# EAGLE schematic motherboard (EAGLE 5.10)
WV: 10V

## Sheet 1 of 7
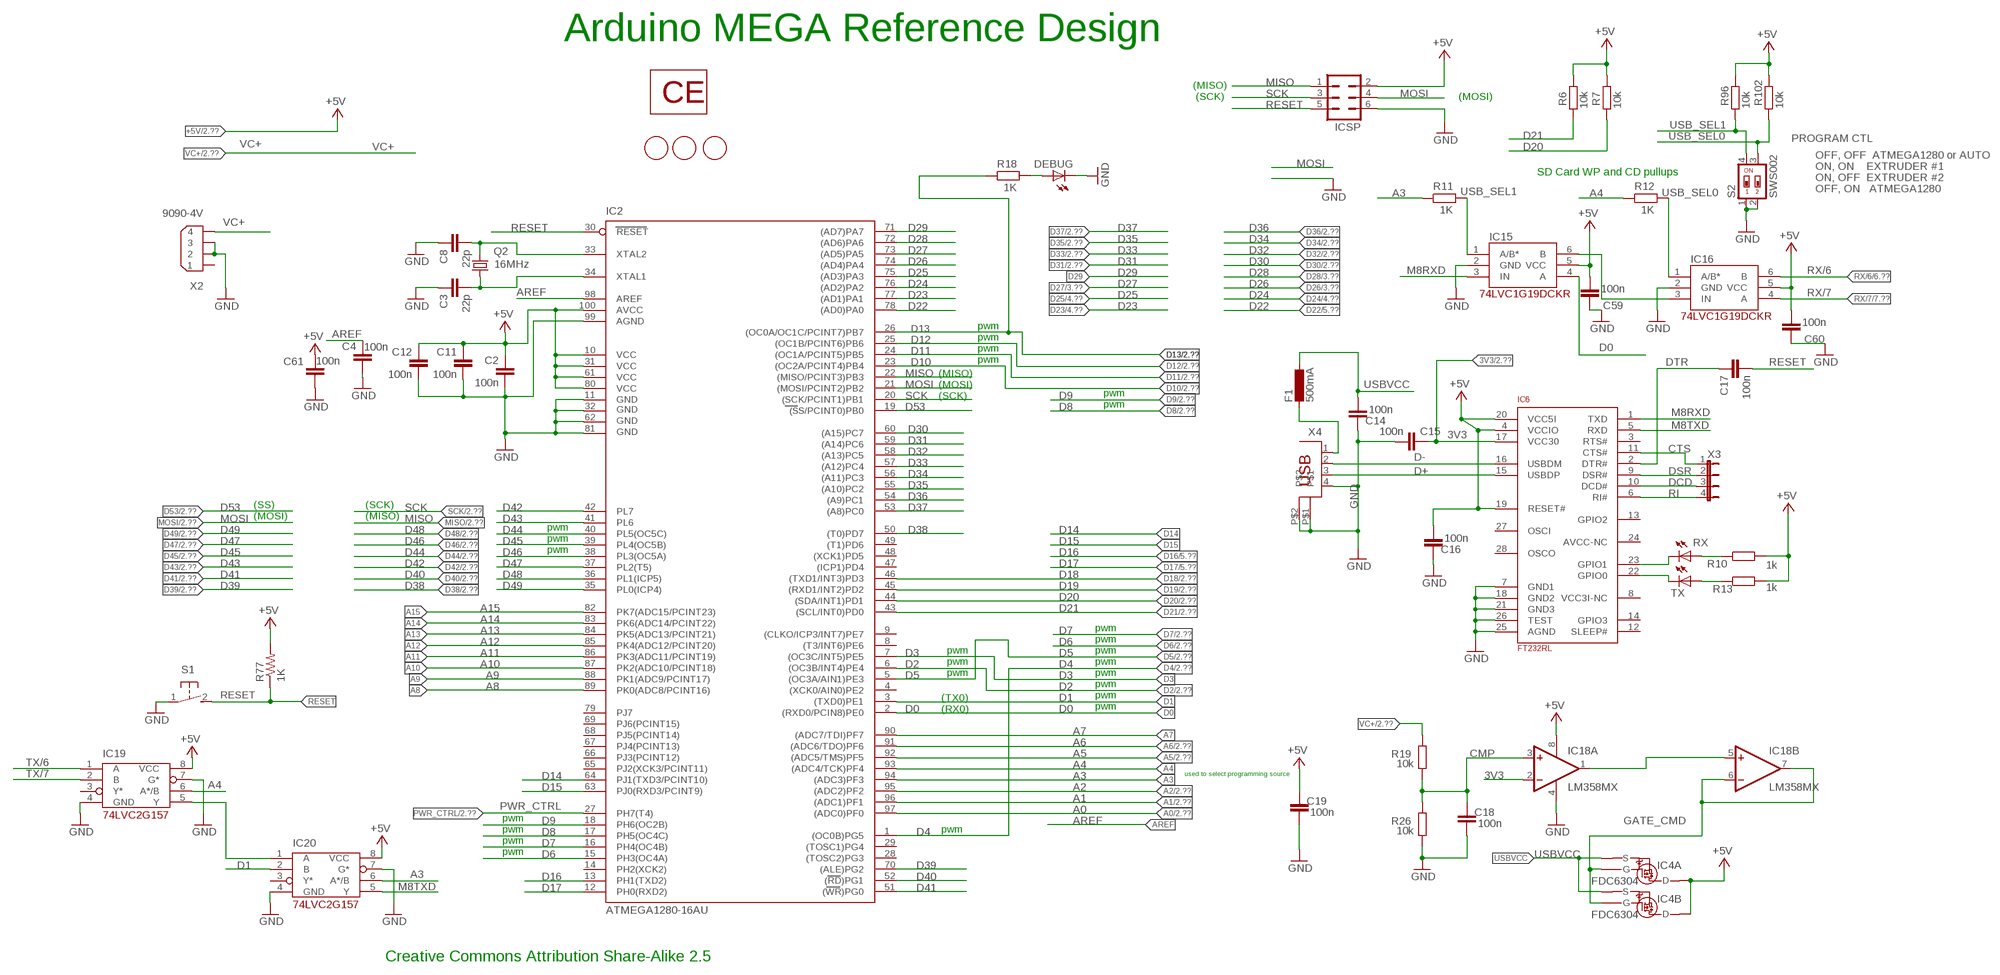
[diagram p0: schematic, sheet 1]

### Parts
C2  100n  C-EU  [C0805RND]
C3  22p  C-EU  [C0805RND]
C4  100n  C-EU  [C0805RND]
C8  22p  C-EU  [C0805RND]
C11  100n  C-EU  [C0805RND]
C12  100n  C-EU  [C0805RND]
C14  100n  C-EU  [C0805RND]
C15  100n  C-EU  [C0805RND]
C16  100n  C-EU  [C0805RND]
C17  100n  C-EU  [C0805RND]
C18  100n  C-EU  [C0805RND]
C19  100n  C-EU  [C0805RND]
C59  100n  C-EU  [C0805RND]
C60  100n  C-EU  [C0805RND]
C61  100n  C-EU  [C0805RND]
DEBUG  LED0805ROUND  [0805RND]
F1  500mA  L-EUL1812  [L1812]
IC2  ATMEGA1280-16AU  [TQFP100]
IC4  FDC6304  [FDC6304]
IC6  FT232RL  [SSOP28]
IC15  741G19  [SC70-6]
IC16  741G19  [SC70-6]
IC18  LM358MX  [SO08]
IC19  74LVC2G157  [DCU_R-PDSO-G8]
IC20  74LVC2G157  [DCU_R-PDSO-G8]
ICSP  ML6  [ML6]
Q2  16MHz  CRYTALHC49S  [HC49/S]
R6  10k  R-EU_  [R0805RND]
R7  10k  R-EU_  [R0805RND]
R10  1k  R-EU_  [R0805RND]
R11  1K  R-EU_  [R0805RND]
R12  1K  R-EU_  [R0805RND]
R13  1k  R-EU_  [R0805RND]
R18  1K  R-EU_  [R0805RND]
R19  10k  R-EU_  [R0805RND]
R26  10k  R-EU_  [R0805RND]
R77  1K  RESISTOR  [0805]
R96  10k  R-EU_  [R0805RND]
R102  10k  R-EU_  [R0805RND]
RX  LED0805ROUND  [0805RND]
S1  31-XX  [B3F-31XX]
S2  SWS002  [SMS-002]
TX  LED0805ROUND  [0805RND]
U$3  FIDUCIALMOUNT  [FIDUCIA-MOUNT]
U$8  FIDUCIALMOUNT  [FIDUCIA-MOUNT]
U$9  FIDUCIALMOUNT  [FIDUCIA-MOUNT]
U$10  CE  [CE-COPPER]
X2  9090-4V  [9090-4V]
X3  JP4E  [JP4]
X4  PN61729  [PN61729]

### Nets
3V3: C15.2 IC6.17(VCC30) IC18.2(A:-IN) ; also sheet 2
+5V [5V_power]: C2.1 C11.1 C12.1 C16.1 C19.2 C59.1 C60.1 C61.1 IC2.10(VCC) IC2.31(VCC1) IC2.61(VCC2) IC2.80(VCC3) IC2.100(AVCC) IC4.4(B:D) IC4.6(A:D) IC6.4(VCCIO) IC6.19(RESET#) IC6.20(VCC5I) IC15.5(VCC) IC16.5(VCC) IC18.8(P:V+) IC19.8(VCC) IC20.8(VCC) ICSP.2 R6.1 R7.1 R10.2 R13.2 R77.2 R96.1 R102.1 ; also sheet 2,3,4,5,6,7
A0: IC2.97((ADC0)PF0) ; also sheet 2
A1: IC2.96((ADC1)PF1) ; also sheet 2
A2: IC2.95((ADC2)PF2) ; also sheet 2
A3: IC2.94((ADC3)PF3) IC20.6(A*/B) R11.1
A4: IC2.93((ADC4/TCK)PF4) IC19.6(A*/B) R12.1
A5: IC2.92((ADC5/TMS)PF5) ; also sheet 2
A6: IC2.91((ADC6/TDO)PF6) ; also sheet 2
A7: IC2.90((ADC7/TDI)PF7)
A8: IC2.89(PK0(ADC8/PCINT16))
A9: IC2.88(PK1(ADC9/PCINT17))
A10: IC2.87(PK2(ADC10/PCINT18))
A11: IC2.86(PK3(ADC11/PCINT19))
A12: IC2.85(PK4(ADC12/PCINT20))
A13: IC2.84(PK5(ADC13/PCINT21))
A14: IC2.83(PK6(ADC14/PCINT22))
A15: IC2.82(PK7(ADC15/PCINT23))
AREF: C4.1 IC2.98(AREF)
CMP: C18.2 IC18.3(A:+IN) R19.1 R26.2
CTS: IC6.11(CTS#) X3.1
D0: IC2.2((RXD0/PCIN8)PE0) IC15.4(A)
D1: IC2.3((TXD0)PE1) IC20.2(B)
D2: IC2.6((OC3B/INT4)PE4) ; also sheet 2
D3: IC2.7((OC3C/INT5)PE5)
D4: IC2.1((OC0B)PG5) ; also sheet 2
D5: IC2.5((OC3A/AIN1)PE3) ; also sheet 2
D6: IC2.15(PH3(OC4A)) ; also sheet 2
D7: IC2.16(PH4(OC4B)) ; also sheet 2
D8: IC2.17(PH5(OC4C)) ; also sheet 2
D9: IC2.18(PH6(OC2B)) ; also sheet 2
D10: IC2.23((OC2A/PCINT4)PB4) ; also sheet 2
D11: IC2.24((OC1A/PCINT5)PB5) ; also sheet 2
D12: IC2.25((OC1B/PCINT6)PB6) ; also sheet 2
D13: IC2.26((OC0A/OC1C/PCINT7)PB7) R18.1 ; also sheet 2
D14: IC2.64(PJ1(TXD3/PCINT10))
D15: IC2.63(PJ0(RXD3/PCINT9))
D16: IC2.13(PH1(TXD2)) ; also sheet 5
D17: IC2.12(PH0(RXD2)) ; also sheet 5
D18: IC2.46((TXD1/INT3)PD3) ; also sheet 2
D19: IC2.45((RXD1/INT2)PD2) ; also sheet 2
D20: IC2.44((SDA/INT1)PD1) R7.2 ; also sheet 2
D21: IC2.43((SCL/INT0)PD0) R6.2 ; also sheet 2
D22: IC2.78((AD0)PA0) ; also sheet 5
D23: IC2.77((AD1)PA1) ; also sheet 4
D24: IC2.76((AD2)PA2) ; also sheet 4
D25: IC2.75((AD3)PA3) ; also sheet 4
D26: IC2.74((AD4)PA4) ; also sheet 3
D27: IC2.73((AD5)PA5) ; also sheet 3
D28: IC2.72((AD6)PA6) ; also sheet 3
D29: IC2.71((AD7)PA7)
D30: IC2.60((A15)PC7) ; also sheet 2
D31: IC2.59((A14)PC6) ; also sheet 2
D32: IC2.58((A13)PC5) ; also sheet 2
D33: IC2.57((A12)PC4) ; also sheet 2
D34: IC2.56((A11)PC3) ; also sheet 2
D35: IC2.55((A10)PC2) ; also sheet 2
D36: IC2.54((A9)PC1) ; also sheet 2
D37: IC2.53((A8)PC0) ; also sheet 2
D38: IC2.50((T0)PD7) ; also sheet 2
D39: IC2.70((ALE)PG2) ; also sheet 2
D40: IC2.52((RD)PG1) ; also sheet 2
D41: IC2.51((WR)PG0) ; also sheet 2
D42: IC2.42(PL7) ; also sheet 2
D43: IC2.41(PL6) ; also sheet 2
D44: IC2.40(PL5(OC5C)) ; also sheet 2
D45: IC2.39(PL4(OC5B)) ; also sheet 2
D46: IC2.38(PL3(OC5A)) ; also sheet 2
D47: IC2.37(PL2(T5)) ; also sheet 2
D48: IC2.36(PL1(ICP5)) ; also sheet 2
D49: IC2.35(PL0(ICP4)) ; also sheet 2
D53: IC2.19((SS/PCINT0)PB0) ; also sheet 2
D+: IC6.15(USBDP) X4.3
D-: IC6.16(USBDM) X4.2
DCD: IC6.10(DCD#) X3.3
DSR: IC6.9(DSR#) X3.2
DTR: C17.1 IC6.2(DTR#)
GATE_CMD: IC4.1(A:G) IC4.3(B:G) IC18.6(B:-IN) IC18.7(B:OUT)
GND [gnd]: C2.2 C3.1 C4.2 C8.1 C11.2 C12.2 C14.2 C15.1 C16.2 C18.1 C19.1 C59.2 C60.2 C61.2 DEBUG.P$2(C) IC2.11(GND) IC2.32(GND1) IC2.62(GND2) IC2.81(GND3) IC2.99(AGND) IC6.7(GND1) IC6.18(GND2) IC6.21(GND3) IC6.25(AGND) IC6.26(TEST) IC15.2(GND) IC16.2(GND) IC18.4(P:V-) IC19.4(GND) IC19.7(G*) IC20.4(GND) IC20.7(G*) ICSP.6 R26.1 S1.1(P) S2.1 S2.2 X2.2 X2.3 X4.4 X4.P$1 X4.P$2 ; also sheet 2,3,4,5,6,7
M8RXD: IC6.1(TXD) IC15.3(IN)
M8TXD: IC6.5(RXD) IC20.5(Y)
MISO: IC2.22((MISO/PCINT3)PB3) ICSP.1 ; also sheet 2
MOSI: IC2.21((MOSI/PCINT2)PB2) ICSP.4 ; also sheet 2
N$6: C3.2 IC2.34(XTAL1) Q2.1
N$7: C8.2 IC2.33(XTAL2) Q2.2
N$8: DEBUG.P$1(A) R18.2
N$9: IC18.1(A:OUT) IC18.5(B:+IN)
N$15: IC6.23(GPIO1) RX.P$2(C)
N$53: IC6.22(GPIO0) TX.P$2(C)
N$54: R10.1 RX.P$1(A)
N$55: R13.1 TX.P$1(A)
N$60 [usbvcc]: F1.2 X4.1
N$101: IC15.6(B) IC16.3(IN)
PWR_CTRL: IC2.27(PH7(T4)) ; also sheet 2
RESET: C17.2 IC2.30(RESET) ICSP.5 R77.1 S1.2(S)
RI: IC6.6(RI#) X3.4
RX/6: IC16.6(B) ; also sheet 6
RX/7: IC16.4(A) ; also sheet 7
SCK: IC2.20((SCK/PCINT1)PB1) ICSP.3 ; also sheet 2
TX67_SEL: IC19.5(Y) IC20.1(A)
TX/6: IC19.1(A) ; also sheet 6
TX/7: IC19.2(B) ; also sheet 7
USB_SEL0: IC16.1(A/B*) R12.2 R102.2 S2.3
USB_SEL1: IC15.1(A/B*) R11.2 R96.2 S2.4
USBVCC [usbvcc]: C14.1 F1.1 IC4.2(B:S) IC4.5(A:S)
VC+ [12V_power]: R19.2 X2.4 ; also sheet 2,3,4,5,6,7
Unconnected: IC2.4((XCK0/AIN0)PE2) IC2.8((T3/INT6)PE6) IC2.9((CLKO/ICP3/INT7)PE7) IC2.14(PH2(XCK2)) IC2.28((TOSC2)PG3) IC2.29((TOSC1)PG4) IC2.47((ICP1)PD4) IC2.48((XCK1)PD5) IC2.49((T1)PD6) IC2.65(PJ2(XCK3/PCINT11)) IC2.66(PJ3(PCINT12)) IC2.67(PJ4(PCINT13)) IC2.68(PJ5(PCINT14)) IC2.69(PJ6(PCINT15)) IC2.79(PJ7) IC6.3(RTS#) IC6.8(VCC3I-NC) IC6.12(SLEEP#) IC6.13(GPIO2) IC6.14(GPIO3) IC6.24(AVCC-NC) IC6.27(OSCI) IC6.28(OSCO) IC19.3(Y*) IC20.3(Y*) X2.1

### Notes on the sheet
- Arduino MEGA Reference Design
- (MISO)
- (SCK) | (MOSI)
- PROGRAM CTL
- OFF, OFF  ATMEGA1280 or AUTO
- ON, ON    EXTRUDER #1
- SD Card WP and CD pullups
- ON, OFF  EXTRUDER #2
- OFF, ON   ATMEGA1280
- pwm
- pwm
- pwm
- pwm
- (MISO)
- (MOSI)
- (SCK) | pwm
- pwm
- (SS) | (SCK)
- (MOSI) | (MISO)
- pwm
- pwm
- pwm
- pwm
- pwm
- pwm | pwm
- pwm | pwm
- pwm | pwm
- pwm
- (TX0) | pwm
- (RX0) | pwm
- used to select programming source
- pwm
- pwm | pwm
- pwm
- pwm
- Creative Commons Attribution Share-Alike 2.5

## Sheet 2 of 7
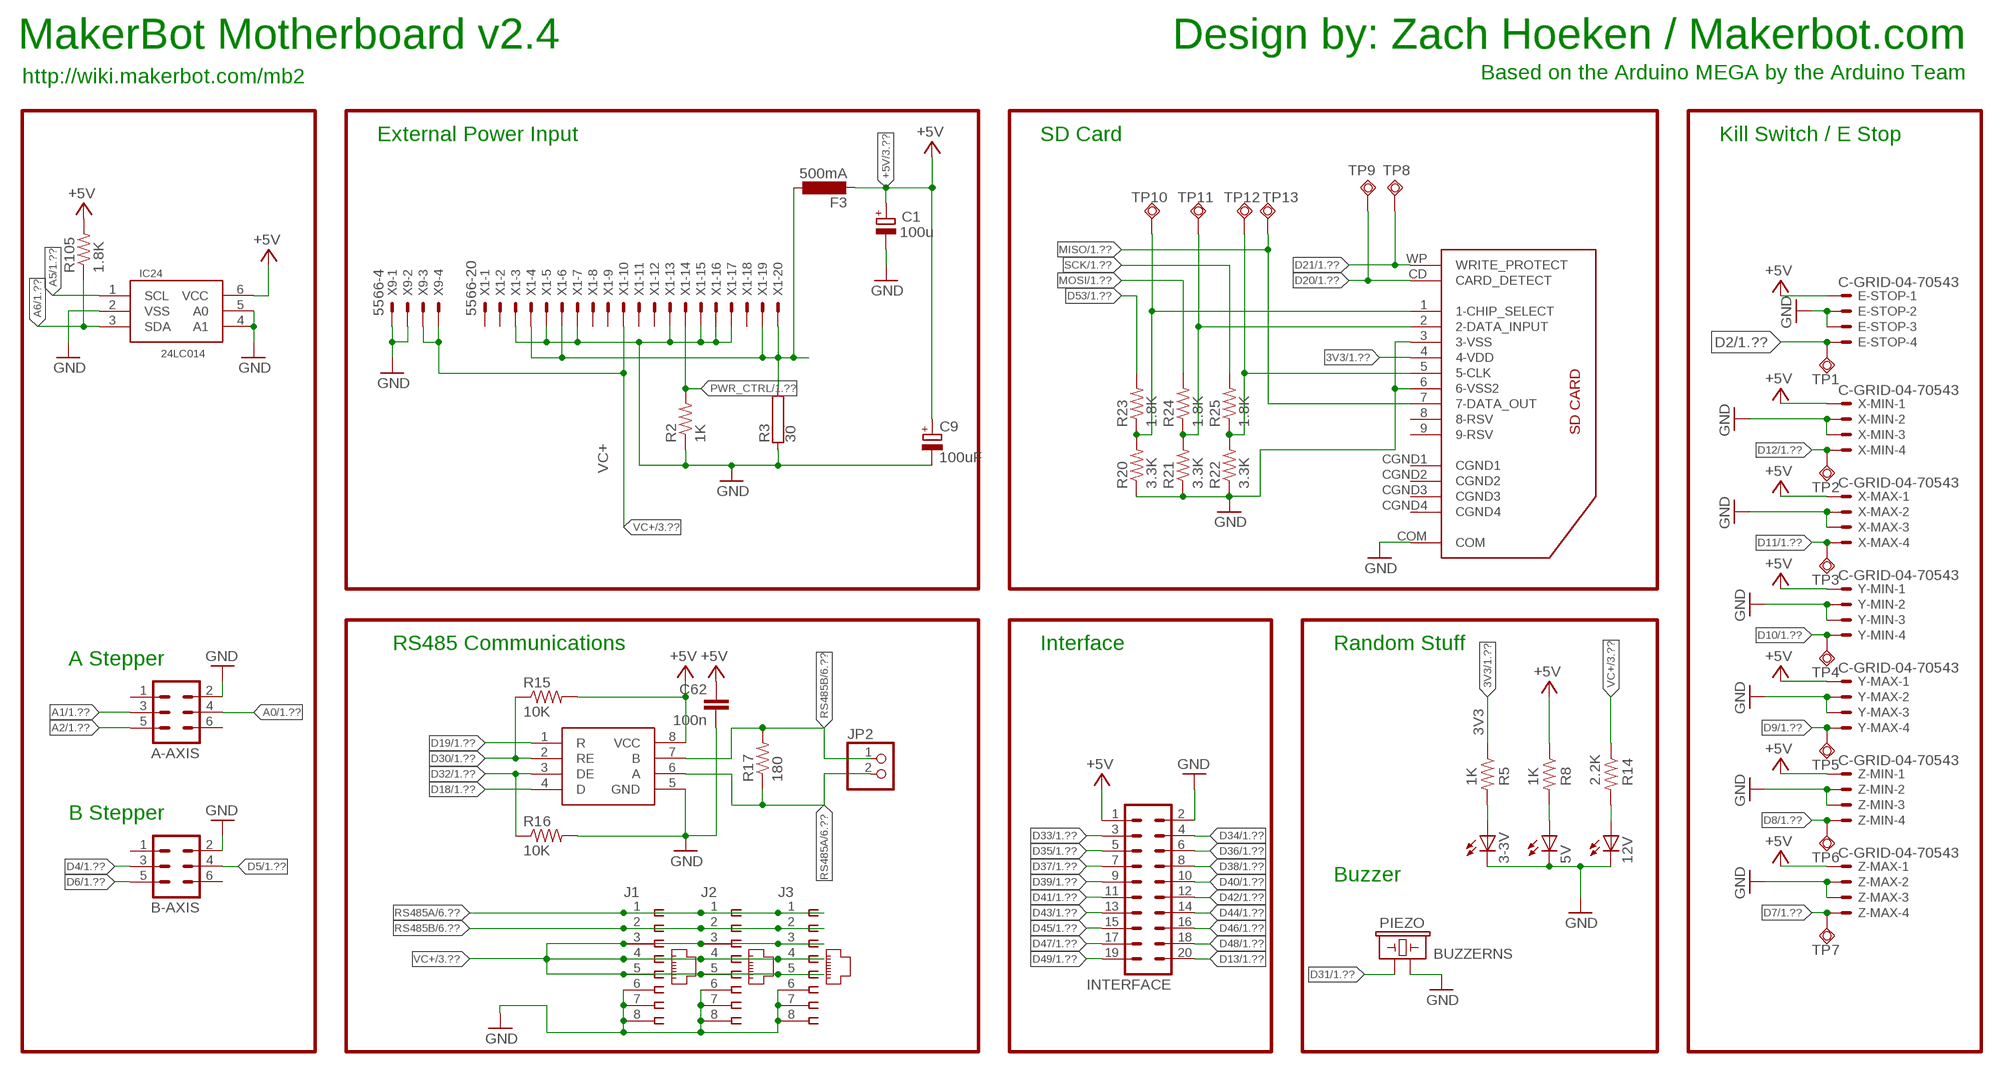
[diagram p1: schematic, sheet 2]

### Parts
3-3V  LED0805  [LED-0805]
5V  LED0805  [LED-0805]
12V  LED0805  [LED-0805]
A-AXIS  ML6  [ML6]
B-AXIS  ML6  [ML6]
C1  100u  CPOL-EUSMCD  [SMC_D]
C9  100uF  CPOL-EUE3.5-8  [E3,5-8]
C62  100n  C-EU  [C0805RND]
E-STOP  C-GRID-04-70543  [70543-04]
F3  500mA  L-EUL1812  [L1812]
IC1  SN75176ASOIC  [SO08]
IC24  24LC014  [SOT23-6]
INTERFACE  ML20  [ML20]
J1  556416-1  [556416-1]
J2  556416-1  [556416-1]
J3  556416-1  [556416-1]
J4  SDCARD-AVX  [KYOCERA-SDCARD]
JP2  PINHD-1X2  [1X02]
PIEZO  BUZZERNS  [BUZZER-12MM-NS]
R2  1K  RESISTOR  [0805]
R3  30  RKH206-8  [KH206-8]
R5  1K  RESISTOR  [0805]
R8  1K  RESISTOR  [0805]
R14  2.2K  RESISTOR  [0805]
R15  10K  RESISTOR  [0805]
R16  10K  RESISTOR  [0805]
R17  180  RESISTOR  [0805]
R20  3.3K  RESISTOR  [0805]
R21  3.3K  RESISTOR  [0805]
R22  3.3K  RESISTOR  [0805]
R23  1.8K  RESISTOR  [0805]
R24  1.8K  RESISTOR  [0805]
R25  1.8K  RESISTOR  [0805]
R105  1.8K  RESISTOR  [0805]
TP1  TPSQTP09R  [TP09R]
TP2  TPSQTP09R  [TP09R]
TP3  TPSQTP09R  [TP09R]
TP4  TPSQTP09R  [TP09R]
TP5  TPSQTP09R  [TP09R]
TP6  TPSQTP09R  [TP09R]
TP7  TPSQTP09R  [TP09R]
TP8  TPSQTP09R  [TP09R]
TP9  TPSQTP09R  [TP09R]
TP10  TPSQTP09R  [TP09R]
TP11  TPSQTP09R  [TP09R]
TP12  TPSQTP09R  [TP09R]
TP13  TPSQTP09R  [TP09R]
X1  5566-20  [5566-20]
X9  5566-4  [5566-4]
X-MAX  C-GRID-04-70543  [70543-04]
X-MIN  C-GRID-04-70543  [70543-04]
Y-MAX  C-GRID-04-70543  [70543-04]
Y-MIN  C-GRID-04-70543  [70543-04]
Z-MAX  C-GRID-04-70543  [70543-04]
Z-MIN  C-GRID-04-70543  [70543-04]

### Nets
3V3: J4.4(4-VDD) R5.1 ; also sheet 1
+5V [5V_power]: C1.+ C9.+ C62.1 E-STOP.1 F3.2 IC1.8(VCC) IC24.6(VCC) INTERFACE.1 R8.1 R15.2 R105.2 X-MAX.1 X-MIN.1 Y-MAX.1 Y-MIN.1 Z-MAX.1 Z-MIN.1 ; also sheet 1,3,4,5,6,7
A0: A-AXIS.4 ; also sheet 1
A1: A-AXIS.3 ; also sheet 1
A2: A-AXIS.5 ; also sheet 1
A5: IC24.1(SCL) ; also sheet 1
A6: IC24.3(SDA) R105.1 ; also sheet 1
ATX_5V [5V_power]: F3.1 R3.2 X1.4 X1.6 X1.19 X1.20
D2: E-STOP.4 TP1.TP ; also sheet 1
D4: B-AXIS.3 ; also sheet 1
D5: B-AXIS.4 ; also sheet 1
D6: B-AXIS.5 ; also sheet 1
D7: TP7.TP Z-MAX.4 ; also sheet 1
D8: TP6.TP Z-MIN.4 ; also sheet 1
D9: TP5.TP Y-MAX.4 ; also sheet 1
D10: TP4.TP Y-MIN.4 ; also sheet 1
D11: TP3.TP X-MAX.4 ; also sheet 1
D12: TP2.TP X-MIN.4 ; also sheet 1
D13: INTERFACE.20 ; also sheet 1
D18: IC1.4(D) ; also sheet 1
D19: IC1.1(R) ; also sheet 1
D20: J4.CD(CARD_DETECT) TP9.TP ; also sheet 1
D21: J4.WP(WRITE_PROTECT) TP8.TP ; also sheet 1
D30: IC1.2(RE) R15.1 ; also sheet 1
D31: PIEZO.+ ; also sheet 1
D32: IC1.3(DE) R16.1 ; also sheet 1
D33: INTERFACE.3 ; also sheet 1
D34: INTERFACE.4 ; also sheet 1
D35: INTERFACE.5 ; also sheet 1
D36: INTERFACE.6 ; also sheet 1
D37: INTERFACE.7 ; also sheet 1
D38: INTERFACE.8 ; also sheet 1
D39: INTERFACE.9 ; also sheet 1
D40: INTERFACE.10 ; also sheet 1
D41: INTERFACE.11 ; also sheet 1
D42: INTERFACE.12 ; also sheet 1
D43: INTERFACE.13 ; also sheet 1
D44: INTERFACE.14 ; also sheet 1
D45: INTERFACE.15 ; also sheet 1
D46: INTERFACE.16 ; also sheet 1
D47: INTERFACE.17 ; also sheet 1
D48: INTERFACE.18 ; also sheet 1
D49: INTERFACE.19 ; also sheet 1
D53: R23.2 ; also sheet 1
GND [gnd]: 3-3V.C 5V.C 12V.C A-AXIS.2 B-AXIS.2 C1.- C9.- C62.2 E-STOP.2 E-STOP.3 IC1.5(GND) IC24.2(VSS) IC24.4(A1) IC24.5(A0) INTERFACE.2 J1.6 J1.7 J1.8 J2.6 J2.7 J2.8 J3.6 J3.7 J3.8 J4.3(3-VSS) J4.6(6-VSS2) J4.COM PIEZO.- R2.1 R3.1 R16.2 R20.1 R21.1 R22.1 X1.3 X1.5 X1.7 X1.13 X1.15 X1.16 X1.17 X9.1 X9.2 X-MAX.2 X-MAX.3 X-MIN.2 X-MIN.3 Y-MAX.2 Y-MAX.3 Y-MIN.2 Y-MIN.3 Z-MAX.2 Z-MAX.3 Z-MIN.2 Z-MIN.3 ; also sheet 1,3,4,5,6,7
MISO: J4.7(7-DATA_OUT) TP13.TP ; also sheet 1
MOSI: R24.2 ; also sheet 1
N$1: 3-3V.A R5.2
N$3: 5V.A R8.2
N$4: J4.5(5-CLK) R22.2 R25.1 TP12.TP
N$5: J4.2(2-DATA_INPUT) R21.2 R24.1 TP11.TP
N$10: 12V.A R14.2
N$11: J4.1(1-CHIP_SELECT) R20.2 R23.1 TP10.TP
PWR_CTRL: R2.2 X1.14 ; also sheet 1
RS485A: IC1.6(A) J1.1 J2.1 J3.1 JP2.2 R17.1 ; also sheet 6,7
RS485B: IC1.7(B) J1.2 J2.2 J3.2 JP2.1 R17.2 ; also sheet 6,7
SCK: R25.2 ; also sheet 1
VC+ [12V_power]: J1.3 J1.4 J1.5 J2.3 J2.4 J2.5 J3.3 J3.4 J3.5 R14.1 X1.10 X9.3 X9.4 ; also sheet 1,3,4,5,6,7
Unconnected: A-AXIS.1 A-AXIS.6 B-AXIS.1 B-AXIS.6 J4.8(8-RSV) J4.9(9-RSV) J4.CGND1 J4.CGND2 J4.CGND3 J4.CGND4 X1.1 X1.2 X1.8 X1.9 X1.11 X1.12 X1.18

### Notes on the sheet
- Design by: Zach Hoeken / Makerbot.com
- MakerBot Motherboard v2.4
- Based on the Arduino MEGA by the Arduino Team
- http://wiki.makerbot.com/mb2
- External Power Input | SD Card | Kill Switch / E Stop
- RS485 Communications | Interface | Random Stuff
- A Stepper
- B Stepper
- Buzzer

## Sheet 3 of 7
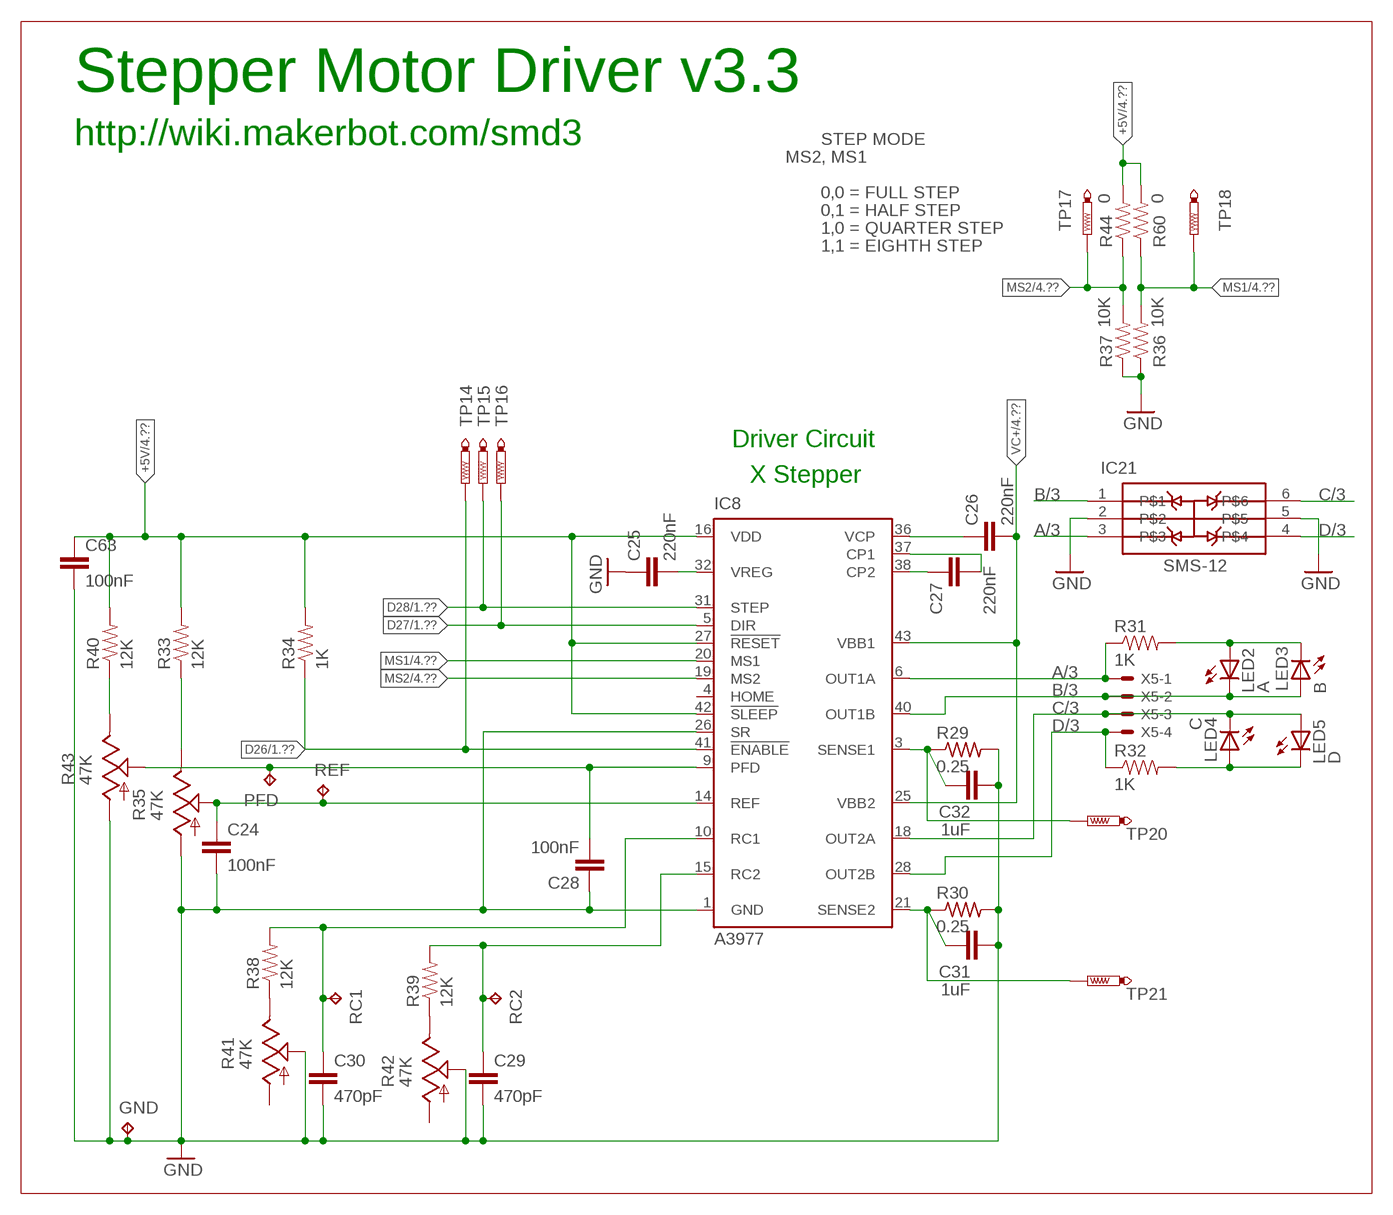
[diagram p2: schematic, sheet 3]

### Parts
C24  100nF  CAP0805  [0805]
C25  220nF  CAP0805  [0805]
C26  220nF  CAP0805  [0805]
C27  220nF  CAP0805  [0805]
C28  100nF  CAP0805  [0805]
C29  470pF  CAP0805  [0805]
C30  470pF  CAP0805  [0805]
C31  1uF  CAP0805  [0805]
C32  1uF  CAP0805  [0805]
C63  100nF  CAP0805  [0805]
GND  TPPAD1-13  [P1-13]
IC8  A3977  [PLCC44]
IC21  TVS-DIODE-ARRAY  [SOT23-6]
LED2  A  LED0805  [LED-0805]
LED3  B  LED0805  [LED-0805]
LED4  C  LED0805  [LED-0805]
LED5  D  LED0805  [LED-0805]
PFD  TPPAD1-13  [P1-13]
R29  0.25  R-US_R2512  [R2512]
R30  0.25  R-US_R2512  [R2512]
R31  1K  RESISTOR  [0805]
R32  1K  RESISTOR  [0805]
R33  12K  RESISTOR  [0805]
R34  1K  RESISTOR  [0805]
R35  47K  TRIM_US-B25P  [B25P]
R36  10K  RESISTOR  [0805]
R37  10K  RESISTOR  [0805]
R38  12K  RESISTOR  [0805]
R39  12K  RESISTOR  [0805]
R40  12K  RESISTOR  [0805]
R41  47K  TRIM_US-B25P  [B25P]
R42  47K  TRIM_US-B25P  [B25P]
R43  47K  TRIM_US-B25P  [B25P]
R44  0  RESISTOR  [0805]
R60  0  RESISTOR  [0805]
RC1  TPPAD1-13  [P1-13]
RC2  TPPAD1-13  [P1-13]
REF  TPPAD1-13  [P1-13]
TP14  PTR1TP09R  [TP09R]
TP15  PTR1TP09R  [TP09R]
TP16  PTR1TP09R  [TP09R]
TP17  PTR1TP09R  [TP09R]
TP18  PTR1TP09R  [TP09R]
TP20  PTR1TP09R  [TP09R]
TP21  PTR1TP09R  [TP09R]
X5  KK-156-4  [KK-156-4]

### Nets
+5V [5V_power]: C63.1 IC8.16(VDD) IC8.27(!RESET) IC8.42(!SLEEP) R33.2 R34.2 R40.2 R44.2 R60.2 ; also sheet 1,2,4,5,6,7
A/3 [power]: IC8.6(OUT1A) IC21.3 R31.1 X5.1
B/3 [power]: IC8.40(OUT1B) IC21.1 LED2.C LED3.A X5.2
C/3 [power]: IC8.18(OUT2A) IC21.6 LED4.C LED5.A X5.3
D26: IC8.41(!ENABLE) R34.1 TP14.TP ; also sheet 1
D27: IC8.5(DIR) TP16.TP ; also sheet 1
D28: IC8.31(STEP) TP15.TP ; also sheet 1
D/3 [power]: IC8.28(OUT2B) IC21.4 R32.1 X5.4
GND [gnd]: C24.2 C25.1 C28.1 C29.2 C30.2 C31.2 C32.2 C63.2 GND.TP IC8.1(GND) IC8.26(SR) IC21.2 IC21.5 R29.2 R30.2 R35.A R36.1 R37.1 R41.S R42.S R43.A ; also sheet 1,2,4,5,6,7
MS1: IC8.20(MS1) R36.2 R60.1 TP18.TP ; also sheet 4,5
MS2: IC8.19(MS2) R37.2 R44.1 TP17.TP ; also sheet 4,5
N$13: C24.1 IC8.14(REF) R35.S REF.TP
N$14: LED2.A LED3.C R31.2
N$16: LED4.A LED5.C R32.2
N$17: R33.1 R35.E
N$18: C25.2 IC8.32(VREG)
N$19: C27.1 IC8.38(CP2)
N$20: C27.2 IC8.37(CP1)
N$21: C26.1 IC8.36(VCP)
N$22 [power]: C32.1 IC8.3(SENSE1) R29.1 TP20.TP
N$23 [power]: C31.1 IC8.21(SENSE2) R30.1 TP21.TP
N$24: C28.2 IC8.9(PFD) PFD.TP R43.S
N$25: R38.1 R41.E
N$26: R39.1 R42.E
N$27: C30.1 IC8.10(RC1) R38.2 RC1.TP
N$28: C29.1 IC8.15(RC2) R39.2 RC2.TP
N$29: R40.1 R43.E
VC+ [12V_power]: C26.2 IC8.25(VBB2) IC8.43(VBB1) ; also sheet 1,2,4,5,6,7
Unconnected: IC8.4(HOME) R41.A R42.A

### Notes on the sheet
- Stepper Motor Driver v3.3
- http://wiki.makerbot.com/smd3 | STEP MODE
- MS2, MS1
- 0,0 = FULL STEP
- 0,1 = HALF STEP
- 1,0 = QUARTER STEP
- 1,1 = EIGHTH STEP
- Driver Circuit
- X Stepper

## Sheet 4 of 7
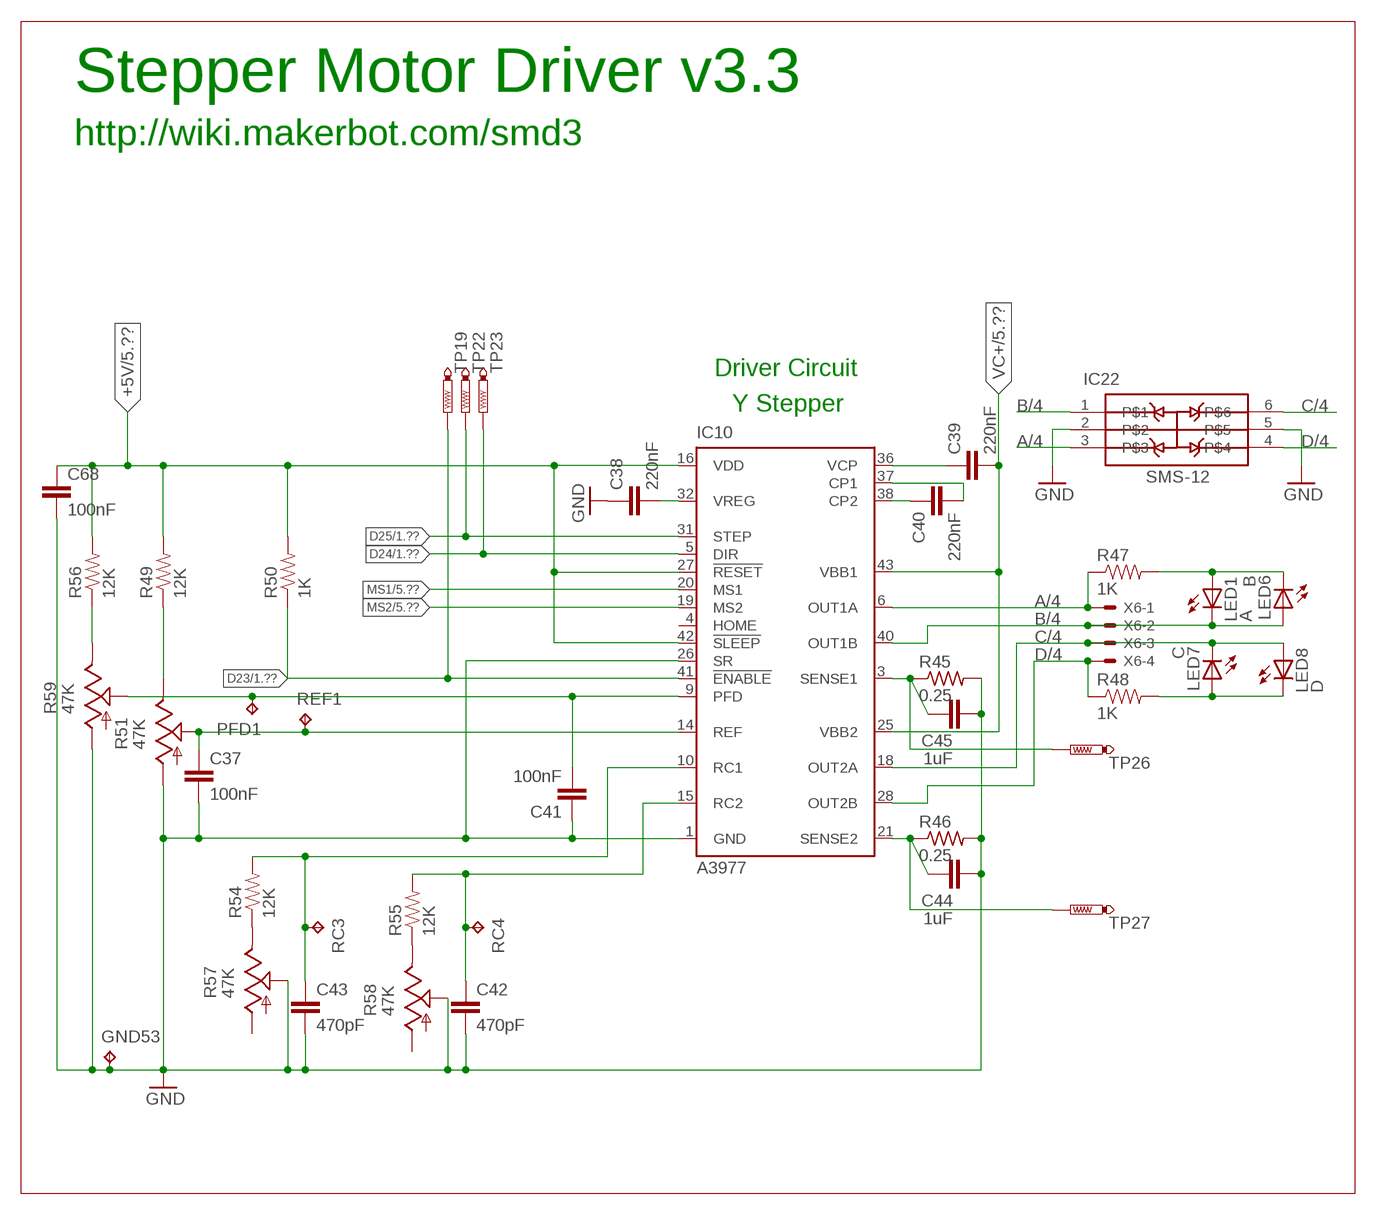
[diagram p3: schematic, sheet 4]

### Parts
C37  100nF  CAP0805  [0805]
C38  220nF  CAP0805  [0805]
C39  220nF  CAP0805  [0805]
C40  220nF  CAP0805  [0805]
C41  100nF  CAP0805  [0805]
C42  470pF  CAP0805  [0805]
C43  470pF  CAP0805  [0805]
C44  1uF  CAP0805  [0805]
C45  1uF  CAP0805  [0805]
C68  100nF  CAP0805  [0805]
GND53  TPPAD1-13  [P1-13]
IC10  A3977  [PLCC44]
IC22  TVS-DIODE-ARRAY  [SOT23-6]
LED1  A  LED0805  [LED-0805]
LED6  B  LED0805  [LED-0805]
LED7  C  LED0805  [LED-0805]
LED8  D  LED0805  [LED-0805]
PFD1  TPPAD1-13  [P1-13]
R45  0.25  R-US_R2512  [R2512]
R46  0.25  R-US_R2512  [R2512]
R47  1K  RESISTOR  [0805]
R48  1K  RESISTOR  [0805]
R49  12K  RESISTOR  [0805]
R50  1K  RESISTOR  [0805]
R51  47K  TRIM_US-B25P  [B25P]
R54  12K  RESISTOR  [0805]
R55  12K  RESISTOR  [0805]
R56  12K  RESISTOR  [0805]
R57  47K  TRIM_US-B25P  [B25P]
R58  47K  TRIM_US-B25P  [B25P]
R59  47K  TRIM_US-B25P  [B25P]
RC3  TPPAD1-13  [P1-13]
RC4  TPPAD1-13  [P1-13]
REF1  TPPAD1-13  [P1-13]
TP19  PTR1TP09R  [TP09R]
TP22  PTR1TP09R  [TP09R]
TP23  PTR1TP09R  [TP09R]
TP26  PTR1TP09R  [TP09R]
TP27  PTR1TP09R  [TP09R]
X6  KK-156-4  [KK-156-4]

### Nets
+5V [5V_power]: C68.1 IC10.16(VDD) IC10.27(!RESET) IC10.42(!SLEEP) R49.2 R50.2 R56.2 ; also sheet 1,2,3,5,6,7
A/4 [power]: IC10.6(OUT1A) IC22.3 R47.1 X6.1
B/4 [power]: IC10.40(OUT1B) IC22.1 LED1.C LED6.A X6.2
C/4 [power]: IC10.18(OUT2A) IC22.6 LED7.C LED8.A X6.3
D23: IC10.41(!ENABLE) R50.1 TP19.TP ; also sheet 1
D24: IC10.5(DIR) TP23.TP ; also sheet 1
D25: IC10.31(STEP) TP22.TP ; also sheet 1
D/4 [power]: IC10.28(OUT2B) IC22.4 R48.1 X6.4
GND [gnd]: C37.2 C38.1 C41.1 C42.2 C43.2 C44.2 C45.2 C68.2 GND53.TP IC10.1(GND) IC10.26(SR) IC22.2 IC22.5 R45.2 R46.2 R51.A R57.S R58.S R59.A ; also sheet 1,2,3,5,6,7
MS1: IC10.20(MS1) ; also sheet 3,5
MS2: IC10.19(MS2) ; also sheet 3,5
N$30: C37.1 IC10.14(REF) R51.S REF1.TP
N$32: LED1.A LED6.C R47.2
N$33: LED7.A LED8.C R48.2
N$34: R49.1 R51.E
N$35: C38.2 IC10.32(VREG)
N$36: C40.1 IC10.38(CP2)
N$37: C40.2 IC10.37(CP1)
N$38: C39.1 IC10.36(VCP)
N$39 [power]: C45.1 IC10.3(SENSE1) R45.1 TP26.TP
N$40 [power]: C44.1 IC10.21(SENSE2) R46.1 TP27.TP
N$41: C41.2 IC10.9(PFD) PFD1.TP R59.S
N$42: R54.1 R57.E
N$43: R55.1 R58.E
N$44: C43.1 IC10.10(RC1) R54.2 RC3.TP
N$45: C42.1 IC10.15(RC2) R55.2 RC4.TP
N$46: R56.1 R59.E
VC+ [12V_power]: C39.2 IC10.25(VBB2) IC10.43(VBB1) ; also sheet 1,2,3,5,6,7
Unconnected: IC10.4(HOME) R57.A R58.A

### Notes on the sheet
- Stepper Motor Driver v3.3
- http://wiki.makerbot.com/smd3
- Driver Circuit
- Y Stepper

## Sheet 5 of 7
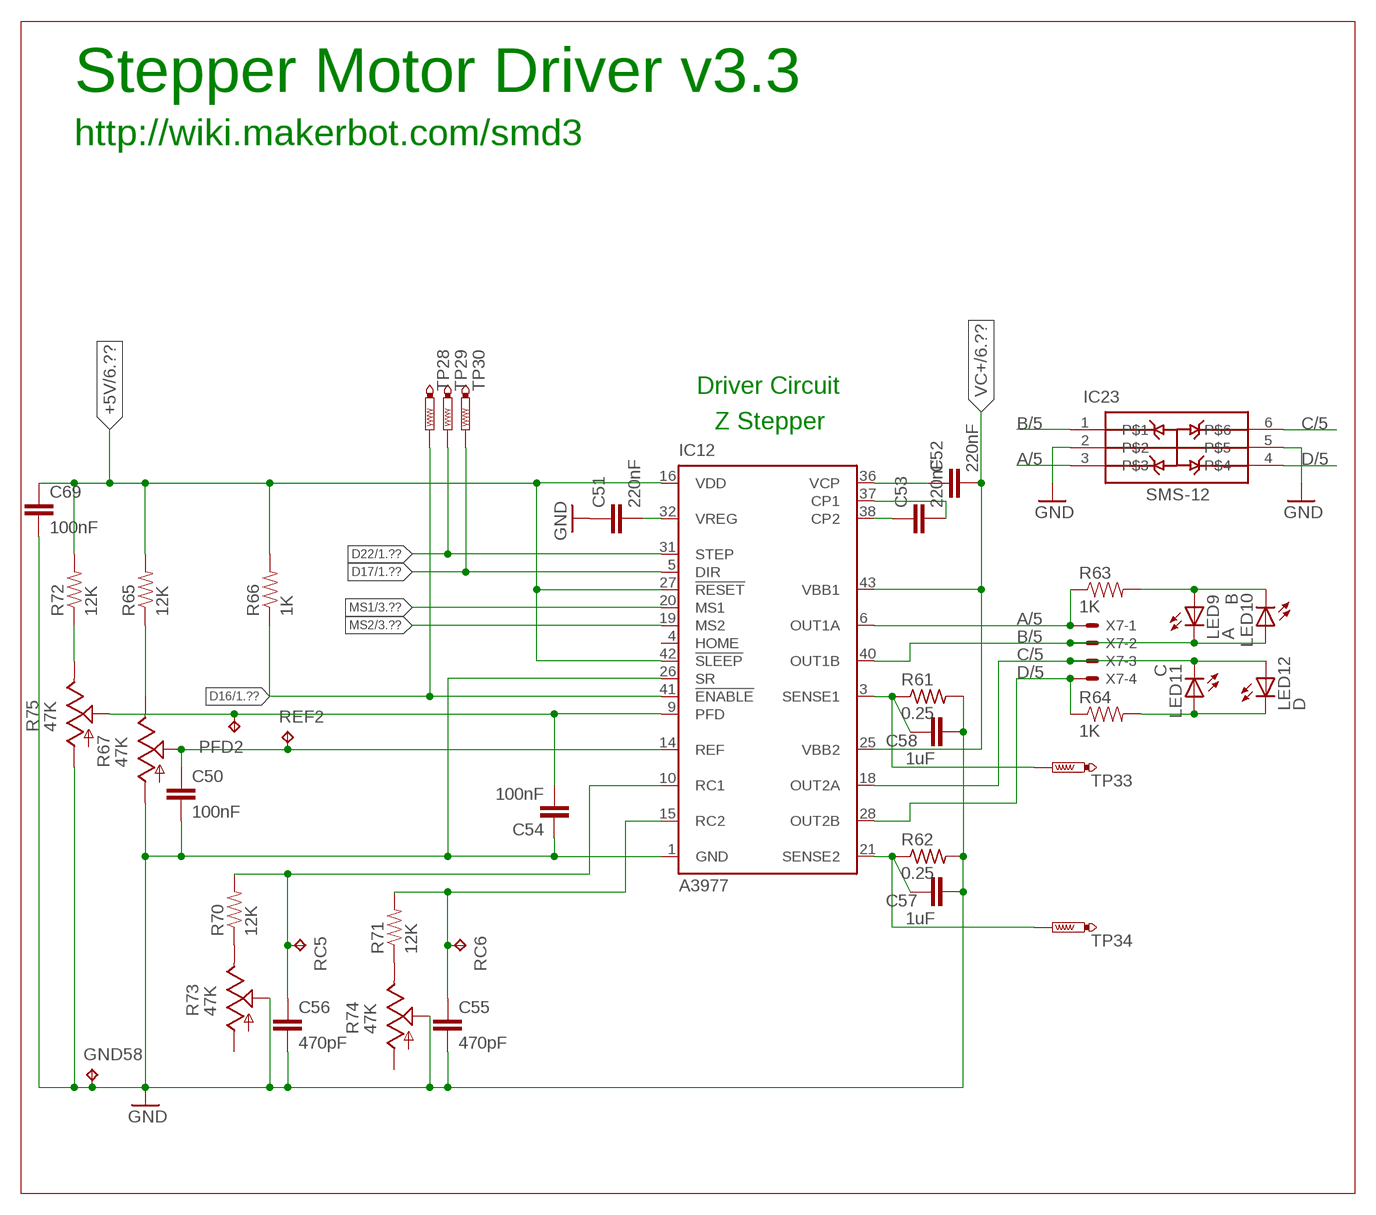
[diagram p4: schematic, sheet 5]

### Parts
C50  100nF  CAP0805  [0805]
C51  220nF  CAP0805  [0805]
C52  220nF  CAP0805  [0805]
C53  220nF  CAP0805  [0805]
C54  100nF  CAP0805  [0805]
C55  470pF  CAP0805  [0805]
C56  470pF  CAP0805  [0805]
C57  1uF  CAP0805  [0805]
C58  1uF  CAP0805  [0805]
C69  100nF  CAP0805  [0805]
GND58  TPPAD1-13  [P1-13]
IC12  A3977  [PLCC44]
IC23  TVS-DIODE-ARRAY  [SOT23-6]
LED9  A  LED0805  [LED-0805]
LED10  B  LED0805  [LED-0805]
LED11  C  LED0805  [LED-0805]
LED12  D  LED0805  [LED-0805]
PFD2  TPPAD1-13  [P1-13]
R61  0.25  R-US_R2512  [R2512]
R62  0.25  R-US_R2512  [R2512]
R63  1K  RESISTOR  [0805]
R64  1K  RESISTOR  [0805]
R65  12K  RESISTOR  [0805]
R66  1K  RESISTOR  [0805]
R67  47K  TRIM_US-B25P  [B25P]
R70  12K  RESISTOR  [0805]
R71  12K  RESISTOR  [0805]
R72  12K  RESISTOR  [0805]
R73  47K  TRIM_US-B25P  [B25P]
R74  47K  TRIM_US-B25P  [B25P]
R75  47K  TRIM_US-B25P  [B25P]
RC5  TPPAD1-13  [P1-13]
RC6  TPPAD1-13  [P1-13]
REF2  TPPAD1-13  [P1-13]
TP28  PTR1TP09R  [TP09R]
TP29  PTR1TP09R  [TP09R]
TP30  PTR1TP09R  [TP09R]
TP33  PTR1TP09R  [TP09R]
TP34  PTR1TP09R  [TP09R]
X7  KK-156-4  [KK-156-4]

### Nets
+5V [5V_power]: C69.1 IC12.16(VDD) IC12.27(!RESET) IC12.42(!SLEEP) R65.2 R66.2 R72.2 ; also sheet 1,2,3,4,6,7
A/5 [power]: IC12.6(OUT1A) IC23.3 R63.1 X7.1
B/5 [power]: IC12.40(OUT1B) IC23.1 LED9.C LED10.A X7.2
C/5 [power]: IC12.18(OUT2A) IC23.6 LED11.C LED12.A X7.3
D16: IC12.41(!ENABLE) R66.1 TP28.TP ; also sheet 1
D17: IC12.5(DIR) TP30.TP ; also sheet 1
D22: IC12.31(STEP) TP29.TP ; also sheet 1
D/5 [power]: IC12.28(OUT2B) IC23.4 R64.1 X7.4
GND [gnd]: C50.2 C51.1 C54.1 C55.2 C56.2 C57.2 C58.2 C69.2 GND58.TP IC12.1(GND) IC12.26(SR) IC23.2 IC23.5 R61.2 R62.2 R67.A R73.S R74.S R75.A ; also sheet 1,2,3,4,6,7
MS1: IC12.20(MS1) ; also sheet 3,4
MS2: IC12.19(MS2) ; also sheet 3,4
N$47: C50.1 IC12.14(REF) R67.S REF2.TP
N$49: LED9.A LED10.C R63.2
N$50: LED11.A LED12.C R64.2
N$51: R65.1 R67.E
N$52: C51.2 IC12.32(VREG)
N$56: C53.1 IC12.38(CP2)
N$57: C53.2 IC12.37(CP1)
N$58: C52.1 IC12.36(VCP)
N$59 [power]: C58.1 IC12.3(SENSE1) R61.1 TP33.TP
N$61 [power]: C57.1 IC12.21(SENSE2) R62.1 TP34.TP
N$62: C54.2 IC12.9(PFD) PFD2.TP R75.S
N$63: R70.1 R73.E
N$64: R71.1 R74.E
N$65: C56.1 IC12.10(RC1) R70.2 RC5.TP
N$66: C55.1 IC12.15(RC2) R71.2 RC6.TP
N$67: R72.1 R75.E
VC+ [12V_power]: C52.2 IC12.25(VBB2) IC12.43(VBB1) ; also sheet 1,2,3,4,6,7
Unconnected: IC12.4(HOME) R73.A R74.A

### Notes on the sheet
- Stepper Motor Driver v3.3
- http://wiki.makerbot.com/smd3
- Driver Circuit
- Z Stepper

## Sheet 6 of 7
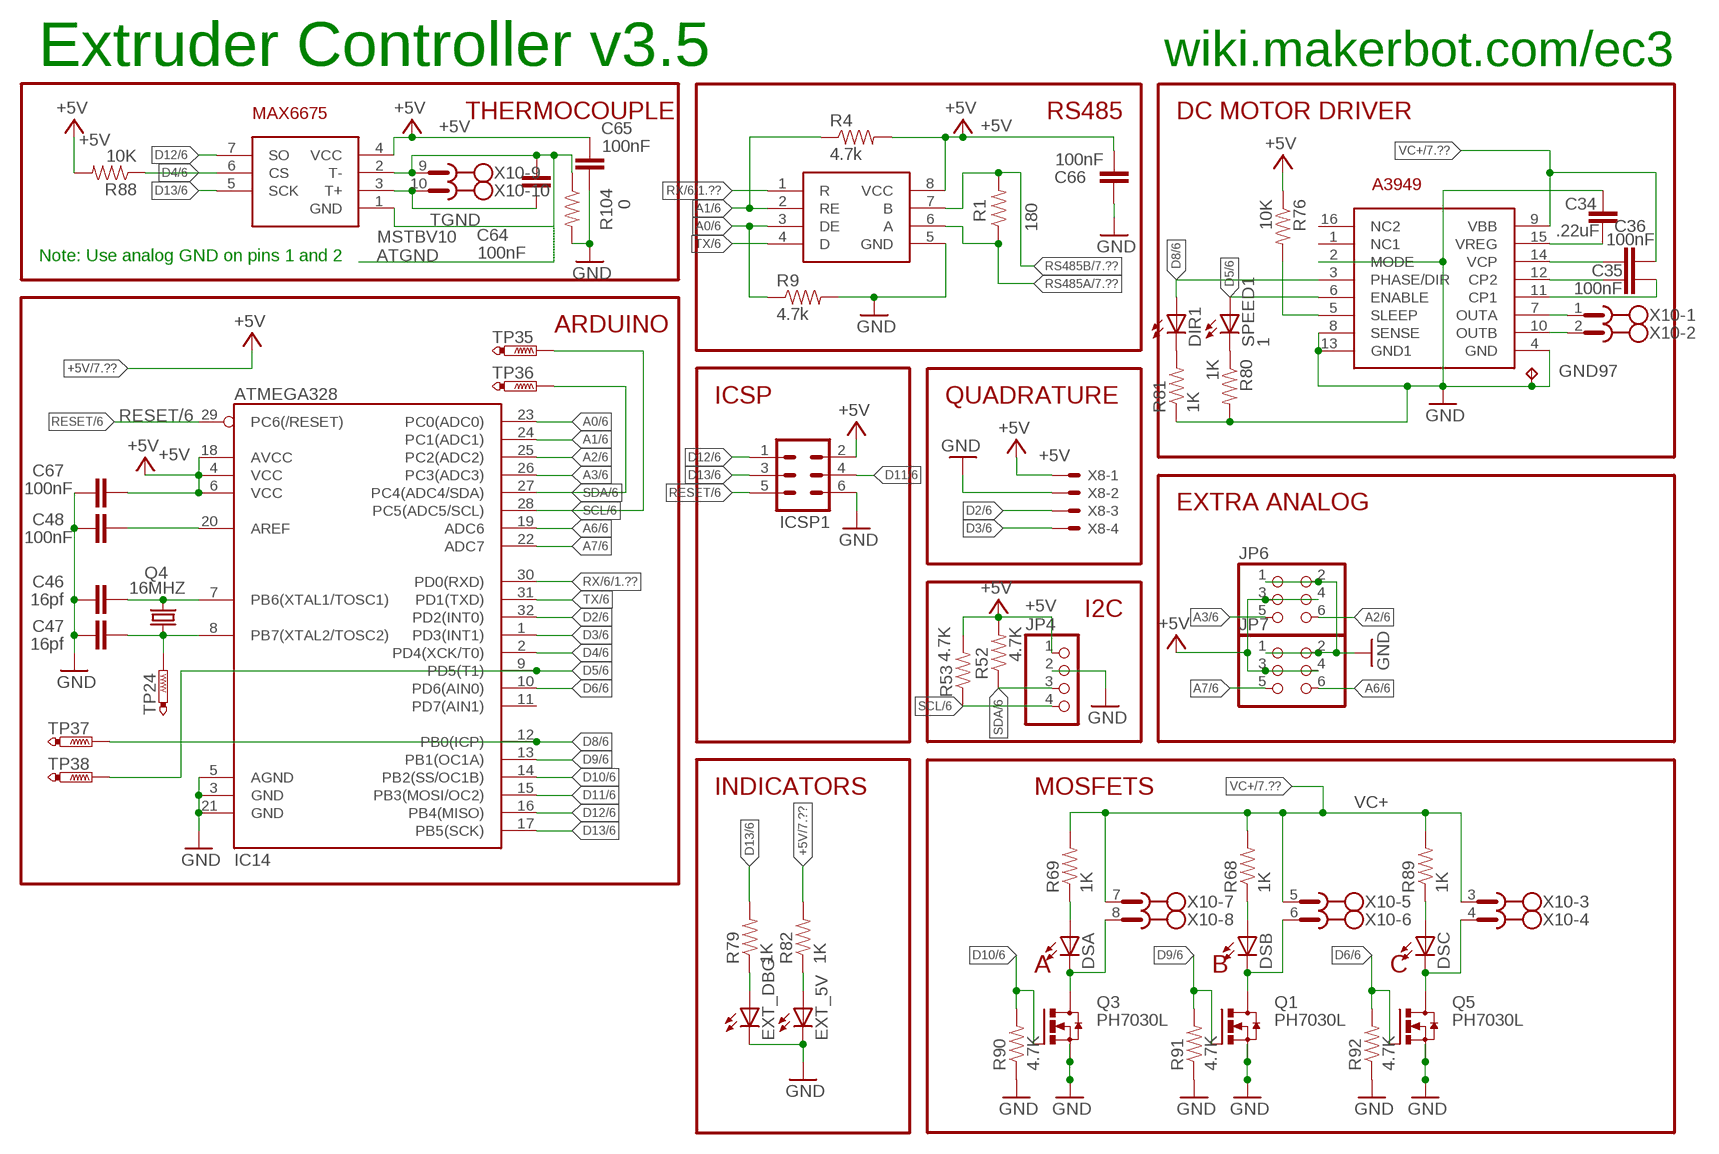
[diagram p5: schematic, sheet 6]

### Parts
C34  .22uF  CAP0805  [0805]
C35  100nF  CAP0805  [0805]
C36  100nF  CAP0805  [0805]
C46  16pf  CAP0805  [0805]
C47  16pf  CAP0805  [0805]
C48  100nF  CAP0805  [0805]
C64  100nF  CAP0805  [0805]
C65  100nF  CAP0805  [0805]
C66  100nF  CAP0805  [0805]
C67  100nF  CAP0805  [0805]
DIR1  LED0805  [LED-0805]
DSA  LED0805  [LED-0805]
DSB  LED0805  [LED-0805]
DSC  LED0805  [LED-0805]
EXT_5V  LED0805  [LED-0805]
EXT_DBG  LED0805  [LED-0805]
GND97  TPPAD1-13  [P1-13]
IC11  SN75176ASOIC  [SO08]
IC13  A3949  [SO16W]
IC14  ATMEGA328  ATMEGA168  [TQFP32-08]
IC17  MAX6675  [SO08]
ICSP1  ML6  [ML6]
JP4  PINHD-1X4  [1X04]
JP6  PINHD-2X3  [2X03]
JP7  PINHD-2X3  [2X03]
Q1  PH7030L  [SOT669]
Q3  PH7030L  [SOT669]
Q4  16MHZ  CRYSTALHC49S  [HC49/S]
Q5  PH7030L  [SOT669]
R1  180  RESISTOR  [0805]
R4  4.7k  RESISTOR  [0805]
R9  4.7k  RESISTOR  [0805]
R52  4.7K  RESISTOR  [0805]
R53  4.7K  RESISTOR  [0805]
R68  1K  RESISTOR  [0805]
R69  1K  RESISTOR  [0805]
R76  10K  RESISTOR  [0805]
R79  1K  RESISTOR  [0805]
R80  1K  RESISTOR  [0805]
R81  1K  RESISTOR  [0805]
R82  1K  RESISTOR  [0805]
R88  10K  RESISTOR  [0805]
R89  1K  RESISTOR  [0805]
R90  4.7K  RESISTOR  [0805]
R91  4.7K  RESISTOR  [0805]
R92  4.7K  RESISTOR  [0805]
R104  0  RESISTOR  [0805]
SPEED1  1  LED0805  [LED-0805]
TP24  PTR1TP09R  [TP09R]
TP35  PTR1TP09R  [TP09R]
TP36  PTR1TP09R  [TP09R]
TP37  PTR1TP09R  [TP09R]
TP38  PTR1TP09R  [TP09R]
X8  C-GRID-04-70543  [70543-04]
X10  MSTBV10  [MSTBV10]

### Nets
+5V [5V_power]: C65.2 C66.2 C67.2 IC11.8(VCC) IC14.4(VCC) IC14.6(VCC) IC14.18(AVCC) IC17.4(VCC) ICSP1.2 JP4.1 JP6.3 JP6.4 JP7.3 JP7.4 R4.2 R52.2 R53.2 R76.1 R82.2 R88.2 X8.1 ; also sheet 1,2,3,4,5,7
A0/6: IC11.3(DE) IC14.23(PC0(ADC0)) R9.1
A1/6: IC11.2(RE) IC14.24(PC1(ADC1)) R4.1
A2/6: IC14.25(PC2(ADC2)) JP6.6
A3/6: IC14.26(PC3(ADC3)) JP6.5
A6/6: IC14.19(ADC6) JP7.6
A7/6: IC14.22(ADC7) JP7.5
APWR [power]: DSA.C Q3.MB(D) X10.8
BPWR [power]: DSB.C Q1.MB(D) X10.6
CPWR [power]: DSC.C Q5.MB(D) X10.4
D2/6: IC14.32(PD2(INT0)) X8.3
D3/6: IC14.1(PD3(INT1)) X8.4
D4/6: IC14.2(PD4(XCK/T0)) IC17.6(CS) R88.1
D5/6: IC13.6(ENABLE) IC14.9(PD5(T1)) SPEED1.A TP38.TP
D6/6: IC14.10(PD6(AIN0)) Q5.4(G) R92.2
D8/6: DIR1.A IC13.3(PHASE/DIR) IC14.12(PB0(ICP)) TP37.TP
D9/6: IC14.13(PB1(OC1A)) Q1.4(G) R91.2
D10/6: IC14.14(PB2(SS/OC1B)) Q3.4(G) R90.2
D11/6: IC14.15(PB3(MOSI/OC2)) ICSP1.4
D12/6: IC14.16(PB4(MISO)) IC17.7(SO) ICSP1.1
D13/6: IC14.17(PB5(SCK)) IC17.5(SCK) ICSP1.3 R79.2
GND [gnd]: C34.1 C46.1 C47.1 C48.1 C65.1 C66.1 C67.1 EXT_5V.C EXT_DBG.C GND97.TP IC11.5(GND) IC13.2(MODE) IC13.4(GND) IC13.8(SENSE) IC13.13(GND1) IC14.3(GND) IC14.5(AGND) IC14.21(GND) ICSP1.6 JP4.2 JP6.1 JP6.2 JP7.1 JP7.2 Q1.1(S) Q1.2(S) Q1.3(S) Q3.1(S) Q3.2(S) Q3.3(S) Q5.1(S) Q5.2(S) Q5.3(S) R9.2 R80.2 R81.1 R90.1 R91.1 R92.1 R104.2 X8.2 ; also sheet 1,2,3,4,5,7
N$2: IC13.5(SLEEP) R76.2
N$31: DSA.A R69.1
N$48: DSB.A R68.1
N$68: C34.2 IC13.15(VREG)
N$69: C35.2 IC13.12(CP2)
N$70: C35.1 IC13.11(CP1)
N$71: C36.1 IC13.14(VCP)
N$73: C46.2 IC14.7(PB6(XTAL1/TOSC1)) Q4.2
N$74: C47.2 IC14.8(PB7(XTAL2/TOSC2)) Q4.1 TP24.TP
N$75: EXT_DBG.A R79.1
N$76: C48.2 IC14.20(AREF)
N$77 [gnd]: IC13.7(OUTA) X10.1
N$78 [gnd]: IC13.10(OUTB) X10.2
N$79: R80.1 SPEED1.C
N$80: DIR1.C R81.2
N$81: EXT_5V.A R82.1
N$97: C64.1 IC17.3(T+) X10.10
N$98: DSC.A R89.1
RESET/6: IC14.29(PC6(/RESET)) ICSP1.5
RS485A: IC11.6(A) R1.1 ; also sheet 2,7
RS485B: IC11.7(B) R1.2 ; also sheet 2,7
RX/6: IC11.1(R) IC14.30(PD0(RXD)) ; also sheet 1
SCL/6: IC14.28(PC5(ADC5/SCL)) JP4.4 R53.1 TP35.TP
SDA/6: IC14.27(PC4(ADC4/SDA)) JP4.3 R52.1 TP36.TP
TGND: C64.2 IC17.1(GND) IC17.2(T-) R104.1 X10.9
TX/6: IC11.4(D) IC14.31(PD1(TXD)) ; also sheet 1
VC+ [12V_power]: C36.2 IC13.9(VBB) R68.2 R69.2 R89.2 X10.3 X10.5 X10.7 ; also sheet 1,2,3,4,5,7
Unconnected: IC13.1(NC1) IC13.16(NC2) IC14.11(PD7(AIN1))

### Notes on the sheet
- wiki.makerbot.com/ec3
- Extruder Controller v3.5
- THERMOCOUPLE | RS485 | DC MOTOR DRIVER
- . | .
- . | .
- . | .
- . | .
- . | .
- . | .
- Note: Use analog GND on pins 1 and 2 | .
- ARDUINO
- ICSP | QUADRATURE
- EXTRA ANALOG
- I2C
- INDICATORS | MOSFETS
- A | B | C

## Sheet 7 of 7
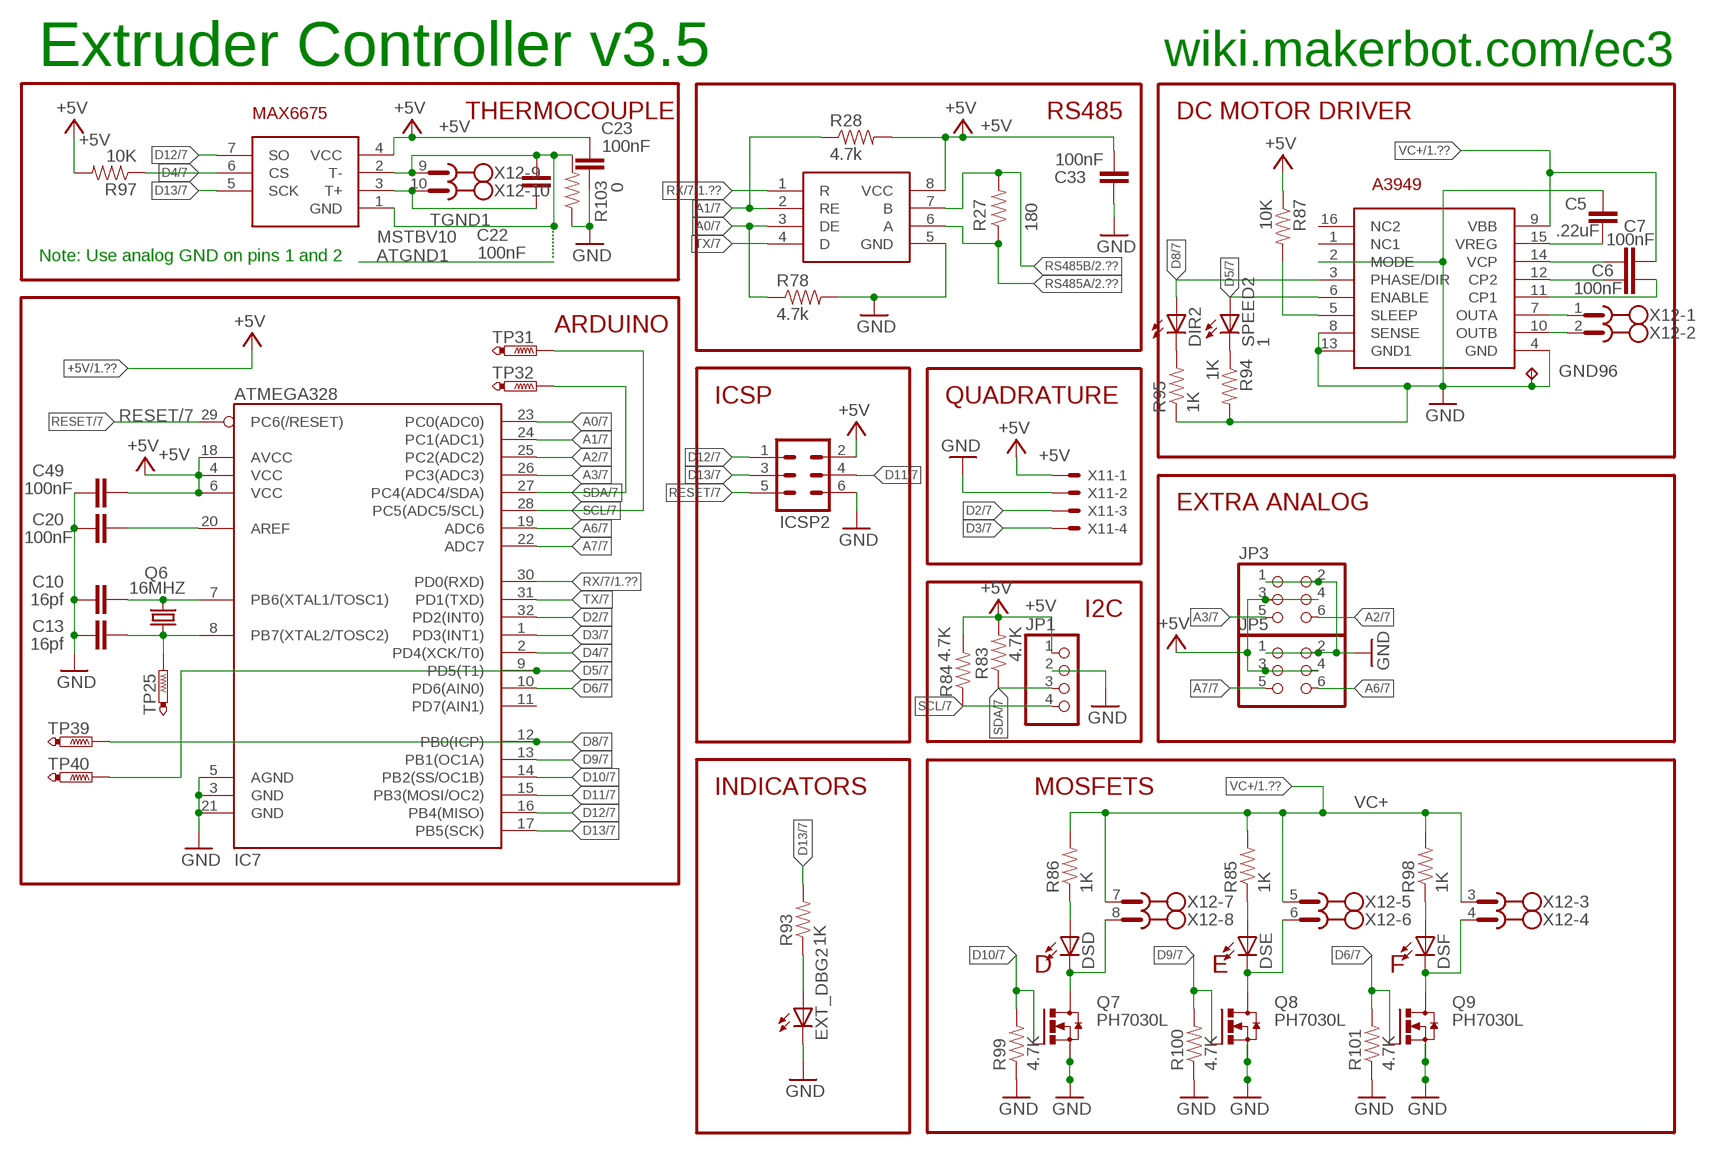
[diagram p6: schematic, sheet 7]

### Parts
C5  .22uF  CAP0805  [0805]
C6  100nF  CAP0805  [0805]
C7  100nF  CAP0805  [0805]
C10  16pf  CAP0805  [0805]
C13  16pf  CAP0805  [0805]
C20  100nF  CAP0805  [0805]
C22  100nF  CAP0805  [0805]
C23  100nF  CAP0805  [0805]
C33  100nF  CAP0805  [0805]
C49  100nF  CAP0805  [0805]
DIR2  LED0805  [LED-0805]
DSD  LED0805  [LED-0805]
DSE  LED0805  [LED-0805]
DSF  LED0805  [LED-0805]
EXT_DBG2  LED0805  [LED-0805]
GND96  TPPAD1-13  [P1-13]
IC3  SN75176ASOIC  [SO08]
IC5  A3949  [SO16W]
IC7  ATMEGA328  ATMEGA168  [TQFP32-08]
IC9  MAX6675  [SO08]
ICSP2  ML6  [ML6]
JP1  PINHD-1X4  [1X04]
JP3  PINHD-2X3  [2X03]
JP5  PINHD-2X3  [2X03]
Q6  16MHZ  CRYSTALHC49S  [HC49/S]
Q7  PH7030L  [SOT669]
Q8  PH7030L  [SOT669]
Q9  PH7030L  [SOT669]
R27  180  RESISTOR  [0805]
R28  4.7k  RESISTOR  [0805]
R78  4.7k  RESISTOR  [0805]
R83  4.7K  RESISTOR  [0805]
R84  4.7K  RESISTOR  [0805]
R85  1K  RESISTOR  [0805]
R86  1K  RESISTOR  [0805]
R87  10K  RESISTOR  [0805]
R93  1K  RESISTOR  [0805]
R94  1K  RESISTOR  [0805]
R95  1K  RESISTOR  [0805]
R97  10K  RESISTOR  [0805]
R98  1K  RESISTOR  [0805]
R99  4.7K  RESISTOR  [0805]
R100  4.7K  RESISTOR  [0805]
R101  4.7K  RESISTOR  [0805]
R103  0  RESISTOR  [0805]
SPEED2  1  LED0805  [LED-0805]
TP25  PTR1TP09R  [TP09R]
TP31  PTR1TP09R  [TP09R]
TP32  PTR1TP09R  [TP09R]
TP39  PTR1TP09R  [TP09R]
TP40  PTR1TP09R  [TP09R]
X11  C-GRID-04-70543  [70543-04]
X12  MSTBV10  [MSTBV10]

### Nets
+5V [5V_power]: C23.2 C33.2 C49.2 IC3.8(VCC) IC7.4(VCC) IC7.6(VCC) IC7.18(AVCC) IC9.4(VCC) ICSP2.2 JP1.1 JP3.3 JP3.4 JP5.3 JP5.4 R28.2 R83.2 R84.2 R87.1 R97.2 X11.1 ; also sheet 1,2,3,4,5,6
A0/7: IC3.3(DE) IC7.23(PC0(ADC0)) R78.1
A1/7: IC3.2(RE) IC7.24(PC1(ADC1)) R28.1
A2/7: IC7.25(PC2(ADC2)) JP3.6
A3/7: IC7.26(PC3(ADC3)) JP3.5
A6/7: IC7.19(ADC6) JP5.6
A7/7: IC7.22(ADC7) JP5.5
APWR1 [power]: DSD.C Q7.MB(D) X12.8
BPWR1 [power]: DSE.C Q8.MB(D) X12.6
CPWR1 [power]: DSF.C Q9.MB(D) X12.4
D2/7: IC7.32(PD2(INT0)) X11.3
D3/7: IC7.1(PD3(INT1)) X11.4
D4/7: IC7.2(PD4(XCK/T0)) IC9.6(CS) R97.1
D5/7: IC5.6(ENABLE) IC7.9(PD5(T1)) SPEED2.A TP40.TP
D6/7: IC7.10(PD6(AIN0)) Q9.4(G) R101.2
D8/7: DIR2.A IC5.3(PHASE/DIR) IC7.12(PB0(ICP)) TP39.TP
D9/7: IC7.13(PB1(OC1A)) Q8.4(G) R100.2
D10/7: IC7.14(PB2(SS/OC1B)) Q7.4(G) R99.2
D11/7: IC7.15(PB3(MOSI/OC2)) ICSP2.4
D12/7: IC7.16(PB4(MISO)) IC9.7(SO) ICSP2.1
D13/7: IC7.17(PB5(SCK)) IC9.5(SCK) ICSP2.3 R93.2
GND [gnd]: C5.1 C10.1 C13.1 C20.1 C23.1 C33.1 C49.1 EXT_DBG2.C GND96.TP IC3.5(GND) IC5.2(MODE) IC5.4(GND) IC5.8(SENSE) IC5.13(GND1) IC7.3(GND) IC7.5(AGND) IC7.21(GND) ICSP2.6 JP1.2 JP3.1 JP3.2 JP5.1 JP5.2 Q7.1(S) Q7.2(S) Q7.3(S) Q8.1(S) Q8.2(S) Q8.3(S) Q9.1(S) Q9.2(S) Q9.3(S) R78.2 R94.2 R95.1 R99.1 R100.1 R101.1 R103.1 X11.2 ; also sheet 1,2,3,4,5,6
N$12: DSD.A R86.1
N$72: DSE.A R85.1
N$83: C5.2 IC5.15(VREG)
N$84: C6.2 IC5.12(CP2)
N$85: C6.1 IC5.11(CP1)
N$86: C7.1 IC5.14(VCP)
N$87: C10.2 IC7.7(PB6(XTAL1/TOSC1)) Q6.2
N$88: C13.2 IC7.8(PB7(XTAL2/TOSC2)) Q6.1 TP25.TP
N$89: EXT_DBG2.A R93.1
N$90: C20.2 IC7.20(AREF)
N$91 [gnd]: IC5.7(OUTA) X12.1
N$92 [gnd]: IC5.10(OUTB) X12.2
N$93: R94.1 SPEED2.C
N$94: DIR2.C R95.2
N$96: C22.1 IC9.3(T+) X12.10
N$99: DSF.A R98.1
N$100: IC5.5(SLEEP) R87.2
RESET/7: IC7.29(PC6(/RESET)) ICSP2.5
RS485A: IC3.6(A) R27.1 ; also sheet 2,6
RS485B: IC3.7(B) R27.2 ; also sheet 2,6
RX/7: IC3.1(R) IC7.30(PD0(RXD)) ; also sheet 1
SCL/7: IC7.28(PC5(ADC5/SCL)) JP1.4 R84.1 TP31.TP
SDA/7: IC7.27(PC4(ADC4/SDA)) JP1.3 R83.1 TP32.TP
TGND1: C22.2 IC9.1(GND) IC9.2(T-) R103.2 X12.9
TX/7: IC3.4(D) IC7.31(PD1(TXD)) ; also sheet 1
VC+ [12V_power]: C7.2 IC5.9(VBB) R85.2 R86.2 R98.2 X12.3 X12.5 X12.7 ; also sheet 1,2,3,4,5,6
Unconnected: IC5.1(NC1) IC5.16(NC2) IC7.11(PD7(AIN1))

### Notes on the sheet
- wiki.makerbot.com/ec3
- Extruder Controller v3.5
- THERMOCOUPLE | RS485 | DC MOTOR DRIVER
- . | .
- . | .
- . | .
- . | .
- . | .
- Note: Use analog GND on pins 1 and 2
- ARDUINO
- ICSP | QUADRATURE
- EXTRA ANALOG
- I2C
- INDICATORS | MOSFETS
- D | E | F

## Power pins joined to a net without a drawn wire
GND: IC8.2(GND) IC8.11(GND) IC8.12(GND) IC8.13(GND) IC8.22(GND) IC8.23(GND) IC8.24(GND) IC8.33(GND) IC8.34(GND) IC8.35(GND) IC8.44(GND) IC10.2(GND) IC10.11(GND) IC10.12(GND) IC10.13(GND) IC10.22(GND) IC10.23(GND) IC10.24(GND) IC10.33(GND) IC10.34(GND) IC10.35(GND) IC10.44(GND) IC12.2(GND) IC12.11(GND) IC12.12(GND) IC12.13(GND) IC12.22(GND) IC12.23(GND) IC12.24(GND) IC12.33(GND) IC12.34(GND) IC12.35(GND) IC12.44(GND)

## Library data of the parts
3-3V 5V 12V DIR1 DIR2 DSA DSB DSC DSD DSE DSF EXT_5V EXT_DBG EXT_DBG2 LED1-LED12 SPEED1 SPEED2 = SparkFun:LED: LEDs Standard schematic elements and footprints for 5mm, 3mm, 1206, and 0603 sized LEDs. 5mm - Spark Fun Electronics SKU : COM-00529 (and others)
A-AXIS B-AXIS = con-ml:ML6: HARTING
C1 = rcl:CPOL-EU: POLARIZED CAPACITOR, European symbol
C2-C4 C8 C11 C12 C14-C19 C59-C62 = rcl:C-EU: CAPACITOR, European symbol
C5-C7 C10 C13 C20 C22-C58 C63-C69 = SparkFun:CAP: Capacitor Standard 0603 ceramic capacitor, and 0.1" leaded capacitor.
C9 = resistor:CPOL-EU: POLARIZED CAPACITOR, European symbol
DEBUG RX TX = led:LED: LED OSRAM: - CHIPLED LG R971, LG N971, LY N971, LG Q971, LY Q971, LO R971, LY R971 LH N974, LH R974 LS Q976, LO Q976, LY Q976 LO Q996 - Hyper CHIPLED LW Q18S LB Q993, LB Q99A, LB R99A - SideLED LS A670, LO A670, LY A670, LG A670, LP A670 LB A673, LV A673, LT A673, LW A673 LH A674 LY A675 LS A676, LA A676, LO A676, LY A676, LW A676 LS A679, LY A679, LG A679 - Hyper Micro SIDELED® LS Y876, LA Y876, LO Y876, LY Y876 LT Y87S - SmartLED LW L88C, LW L88S LB L89C, LB L89S, LG L890 LS L89K, LO L89K, LY L89K LS L896, LA L896, LO L896, LY L896 - TOPLED LS T670, LO T670, LY T670, LG T670, LP T670 LSG T670, LSP T670, LSY T670, LOP T670, LYG T670 LG T671, LOG T671, LSG T671 LB T673, LV T673, LT T673, LW T673 LH T674 LS T676, LA T676, LO T676, LY T676, LB T676, LH T676, LSB T676, LW T676 LB T67C, LV T67C, LT T67C, LS T67K, LO T67K, LY T67K, LW E67C LS E67B, LA E67B, LO E67B, LY E67B, LB E67C, LV E67C, LT E67C LW T67C LS T679, LY T679, LG T679 LS T770, LO T770, LY T770, LG T770, LP T770 LB T773, LV T773, LT T773, LW T773 LH T774 LS E675, LA E675, LY E675, LS T675 LS T776, LA T776, LO T776, LY T776, LB T776 LHGB T686 LT T68C, LB T68C - Hyper Mini TOPLED® LB M676 - Mini TOPLED Santana® LG M470 LS M47K, LO M47K, LY M47K Source: http://www.osram.convergy.de/
E-STOP X-MAX X-MIN Y-MAX Y-MIN Z-MAX Z-MIN = con-molex:C-GRID-04: CONNECTOR wire to board 2.54 mm (0.100") pitch header
F1 F3 = rcl:L-EU: INDUCTOR, European symbol
GND GND53 GND58 GND96 GND97 PFD PFD1 PFD2 RC1-RC6 REF REF1 REF2 = testpad:TP: Test pad
IC1 IC3 IC11 = reprap:SN75176A
IC2 = atmel-2005:ATMEGA*: MICROCONTROLLER 64/128/256 Kbytes FLASH 4 Kbytes EEPROM 8 Kbytes SRAM 86 General Purpose I/O pins 12-channels16-bit PWM 4 x Serial USARTs 16-channels 10-bit A/D
IC4 = fairchild-semic:FDC6304: Dual P-Channel FET with logic level control and low RDSon
IC5 IC13 = reprap:A3949
IC6 = SmartPrj:FT232RL
IC7 IC14 = SparkFun:ATMEGA168
IC8 IC10 IC12 = linear:A3977: MICROSTEPPING DMOS DRIVER WITH TRANSLATOR Source: http://allegromicro.com/datafile/3977.pdf
IC9 IC17 = reprap:MAX6675: Thermocouple amplifier and A to D converter
IC15 IC16 = 74xx-little-us:74*1G19
IC18 = linear:LM358: OP AMP also LM158; LM258; LM2904 Source: http://cache.national.com/ds/LM/LM158.pdf
IC19 IC20 = 74xx-little-us:74*2G157: 2-1 MUX
IC21-IC23 = reprap:TVS-DIODE-ARRAY: Transient Voltage Protection Diode Array
IC24 = microchip:24LC014: 128x8 EEPROM with I2C access
ICSP ICSP1 ICSP2 = con-harting-ml:ML6: HARTING
INTERFACE = con-harting-ml:ML20: HARTING
J1-J3 = con-amp:556416-1: AMP connector
J4 = reprap:SDCARD-AVX
JP1 JP4 = pinhead:PINHD-1X4: PIN HEADER
JP2 = pinhead:PINHD-1X2: PIN HEADER
JP3 JP5-JP7 = pinhead:PINHD-2X3: PIN HEADER
PIEZO = SparkFun:BUZZER: Buzzer 12mm Spark Fun Electronics SKU : Comp-Buzzer
Q1 Q3 Q5 Q7-Q9 = transistor-power:PH7030L: N-channel TrenchMOS (TM) logic level FET Source: http://www.nxp.com/acrobat_download/datasheets/PH7030L_4.pdf
Q2 = crystal:CRYTAL: CRYSTAL
Q4 Q6 = crystal:CRYSTAL: CRYSTAL
R1 R2 R4 R5 R8 R9 R14-R17 R20-R25 R27 R28 R31-R34 R36-R40 R44 R47-R50 R52-R56 R60 R63-R66 R68-R72 R76-R95 R97-R101 R103-R105 = SparkFun:RESISTOR: Resistor Basic schematic elements and footprints for 0603, 1206, and PTH 1/10th watt (small) resistors.
R3 = resistor-power:R: Power Resitor
R6 R7 R10-R13 R18 R19 R26 R96 R102 = rcl:R-EU_: RESISTOR, European symbol
R29 R30 R45 R46 R61 R62 = rcl:R-US_: RESISTOR, American symbol
R35 R41-R43 R51 R57-R59 R67 R73-R75 = reprap:TRIM_US-: POTENTIOMETER
S1 = switch-omron:31-XX: OMRON SWITCH
S2 = smd-special:SWS002: SMD Dip Switch 2 pol.
TP1-TP13 = testpad:TPSQ: Test pad
TP14-TP40 = testpad:PTR1: TEST PIN
U$3 U$8 U$9 = SmartPrj:FIDUCIALMOUNT
U$10 = SmartPrj:CE
X1 = con-molex:5566-20: Mini FIT connector 20 pol ATX PC-Motherboard Power connector Source: http://www.molex.com
X2 = con-thomas-betts:9090-4: Disk Drive Power four position Source: Thomas & Betts Electronic Interconnects Eiropean Edition 1998
X3 = jumper:JP4E: JUMPER
X4 = SmartPrj:PN61729: BERG USB connector
X5-X7 = con-molex:KK-156-4: KK 156 HEADER Source: http://www.molex.com/pdm_docs/sd/026604100_sd.pdf
X8 X11 = reprap:C-GRID-04: CONNECTOR wire to board 2.54 mm (0.100") pitch header
X9 = con-molex:5566-4: Mini FIT connector 4 pol Source: http://www.molex.com
X10 X12 = con-phoenix-508:MSTBV10: PHOENIX

## Net classes
0 default: width 0.152 mm, drill 0.406 mm, clearance 0.203 mm
1 power: width 0.61 mm, drill 0.711 mm, clearance 0.203 mm
2 gnd: width 0.305 mm, drill 0.711 mm, clearance 0.203 mm
3 usbvcc: width 0.508 mm, drill 0.711 mm, clearance 0.203 mm
4 5V_power: width 0.406 mm, drill 0.711 mm, clearance 0.203 mm
5 12V_power: width 1.524 mm, drill 0.711 mm, clearance 0.203 mm